# Altium schematic sheet JLink_ARM-OB_072_Sch.SchDoc: Jlink_ARM-OB 072
size 177 x 127 mm; Author: Hom; CompanyName: KitSprout; DrawnBy: Hom; Engineer: Hom; Organization: KitSprout; Revision: A; SheetNumber: 1; SheetTotal: 1; Version: 1.0; LibVersion: 2.5
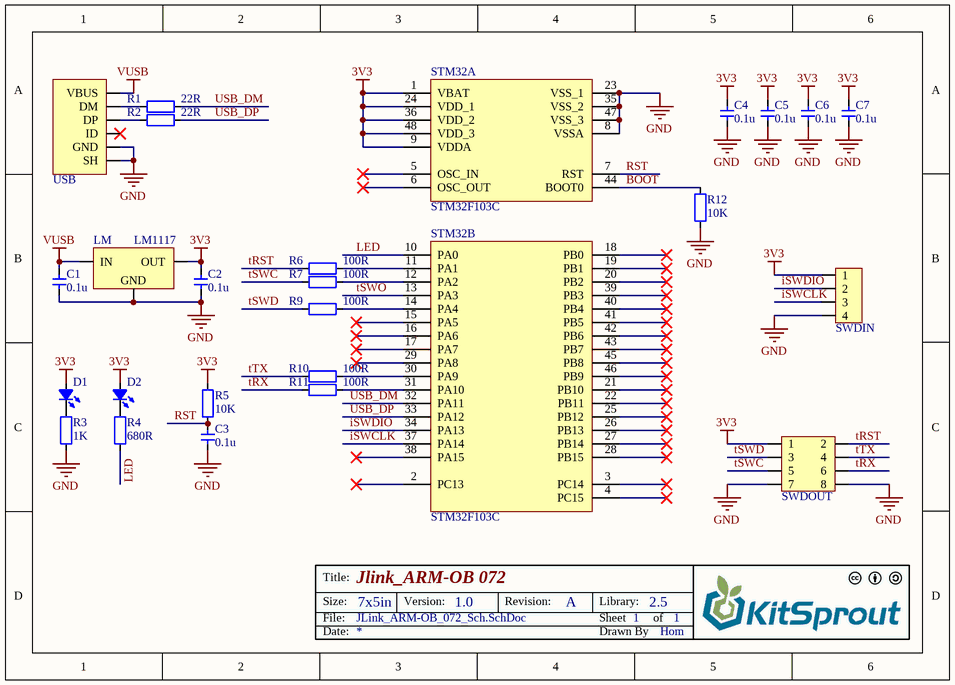
[diagram p0: JLink_ARM-OB_072_Sch.SchDoc]

## Parts
C1  value 0.1u  [CAP_0603]  (hidden comment: Cap_0603)
C2  value 0.1u  [CAP_0603]  (hidden comment: Cap_0603)
C3  value 0.1u  [CAP_0603]  (hidden comment: Cap_0603)
C4  value 0.1u  [CAP_0603]  (hidden comment: Cap_0603)
C5  value 0.1u  [CAP_0603]  (hidden comment: Cap_0603)
C6  value 0.1u  [CAP_0603]  (hidden comment: Cap_0603)
C7  value 0.1u  [CAP_0603]  (hidden comment: Cap_0603)
D1  LED_0603  [LED_0603_BLUE]  (value not drawn)
D2  LED_0603  [LED_0603_GREEN]  (value not drawn)
LM  LM1117  [SOT223-3]
R1  value 22R  [RES_0603]  (hidden comment: Res_0603)
R2  value 22R  [RES_0603]  (hidden comment: Res_0603)
R3  value 1K  [RES_0603]  (hidden comment: Res_0603)
R4  value 680R  [RES_0603]  (hidden comment: Res_0603)
R5  value 10K  [RES_0603]  (hidden comment: Res_0603)
R6  value 100R  [RES_0603]  (hidden comment: Res_0603)
R7  value 100R  [RES_0603]  (hidden comment: Res_0603)
R9  value 100R  [RES_0603]  (hidden comment: Res_0603)
R10  value 100R  [RES_0603]  (hidden comment: Res_0603)
R11  value 100R  [RES_0603]  (hidden comment: Res_0603)
R12  value 10K  [RES_0603]  (hidden comment: Res_0603)
STM32  STM32F103C  [LQFP_P0.5_48]  (parts A,B of 2)
SWDIN  HDR1x4_1.27  [HDR1X4_1.27_180]  (value not drawn)
SWDOUT  HDR2x4_2.54  [HDR2X4_2.54_180H]  (value not drawn)
USB  USB_Micro  [USB_Micro-AB]  (value not drawn)

## Nets
3V3: C2.2 C4.2 C5.2 C6.2 C7.2 D1.1(A) D2.1(A) LM.2(OUT) R5.2 STM32.1(VBAT) STM32.9(VDDA) STM32.24(VDD_1) STM32.36(VDD_2) STM32.48(VDD_3) SWDIN.1 SWDOUT.1
GND: C1.1 C2.1 C3.1 C4.1 C5.1 C6.1 C7.1 LM.1(GND) R3.1 R12.1 STM32.8(VSSA) STM32.23(VSS_1) STM32.35(VSS_2) STM32.47(VSS_3) SWDIN.4 SWDOUT.7 SWDOUT.8 USB.0(SH) USB.5(GND)
VUSB: C1.2 LM.3(IN) USB.1(VBUS)
BOOT: R12.2 STM32.44(BOOT0)
iSWCLK: STM32.37(PA14) SWDIN.3
iSWDIO: STM32.34(PA13) SWDIN.2
LED: R4.1 STM32.10(PA0)
RST: C3.2 R5.1 STM32.7(RST)
tRST: R6.1 SWDOUT.2
tRX: R11.1 SWDOUT.6
tSWC: R7.1 SWDOUT.5
tSWD: R9.1 SWDOUT.3
tSWO: STM32.13(PA3)
tTX: R10.1 SWDOUT.4
USB_DM: R1.2 STM32.32(PA11)
USB_DP: R2.2 STM32.33(PA12)
NetD1_2: D1.2(K) R3.2
NetD2_2: D2.2(K) R4.2
NetR1_1: R1.1 USB.2(DM)
NetR2_1: R2.1 USB.3(DP)
NetR6_2: R6.2 STM32.11(PA1)
NetR7_2: R7.2 STM32.12(PA2)
NetR9_2: R9.2 STM32.14(PA4)
NetR10_2: R10.2 STM32.30(PA9)
NetR11_2: R11.2 STM32.31(PA10)

Not connected (* = marked no-connect by the designer): STM32 2(PC13)* 3(PC14)* 4(PC15)* 5(OSC_IN)* 6(OSC_OUT)* 15(PA5)* 16(PA6)* 17(PA7)* 18(PB0)* 19(PB1)* 20(PB2)* 21(PB10)* 22(PB11)* 25(PB12)* 26(PB13)* 27(PB14)* 28(PB15)* 29(PA8)* 38(PA15)* 39(PB3)* 40(PB4)* 41(PB5)* 42(PB6)* 43(PB7)* 45(PB8)* 46(PB9)*; USB 4(ID)*

## Notes on the sheet
- Title:
- Size:
- Date:
- File:
- 7x5in
- Version:
- Revision:
- Sheet
- Drawn By
- Library:
- of

## Library data of the parts
C1-C7 = Cap_0603: Capacitor
D1 D2 = LED_0603: LED
LM = LM1117: Power
R1-R7 R9-R12 = Res_0603: Resistor
STM32 = STM32F103C: MCU
SWDIN = HDR1x4_1.27: Header
SWDOUT = HDR2x4_2.54: Header
USB = USB_Micro: USB